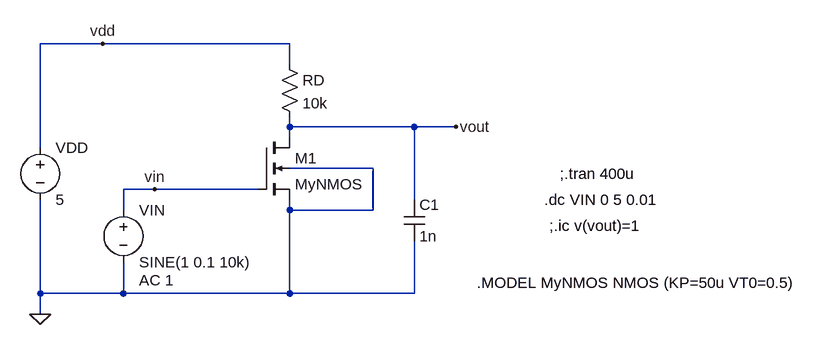
[diagram p0: schematic Figure_2-7_CS_DC_sweep.asc]
Figure_2-7_CS_DC_sweep.asc, the LTspice schematic file:
Version 4
SHEET 1 1404 680
WIRE 320 16 224 16
WIRE 608 16 320 16
WIRE 608 48 608 16
WIRE 608 144 608 128
WIRE 800 144 608 144
WIRE 864 144 800 144
WIRE 608 160 608 144
WIRE 224 176 224 16
WIRE 736 208 608 208
WIRE 400 240 352 240
WIRE 560 240 400 240
WIRE 800 256 800 144
WIRE 352 272 352 240
WIRE 608 272 608 256
WIRE 736 272 736 208
WIRE 736 272 608 272
WIRE 224 400 224 256
WIRE 352 400 352 352
WIRE 352 400 224 400
WIRE 608 400 608 272
WIRE 608 400 352 400
WIRE 800 400 800 320
WIRE 800 400 608 400
WIRE 224 432 224 400
FLAG 224 432 0
FLAG 864 144 vout
FLAG 400 240 vin
FLAG 320 16 vdd
SYMBOL nmos4 560 160 R0
SYMATTR InstName M1
SYMATTR Value MyNMOS
SYMATTR Value2 l=1u w=20u
SYMBOL voltage 352 256 R0
WINDOW 123 24 124 Left 2
WINDOW 39 0 0 Left 2
SYMATTR Value2 AC 1
SYMATTR InstName VIN
SYMATTR Value SINE(1 0.1 10k)
SYMBOL voltage 224 160 R0
WINDOW 123 0 0 Left 2
WINDOW 39 0 0 Left 2
SYMATTR InstName VDD
SYMATTR Value 5
SYMBOL res 592 32 R0
SYMATTR InstName RD
SYMATTR Value 10k
SYMBOL cap 784 256 R0
SYMATTR InstName C1
SYMATTR Value 1n
TEXT 896 384 Left 2 !.MODEL MyNMOS NMOS (KP=50u VT0=0.5)
TEXT 1024 216 Left 2 !;.tran 400u
TEXT 1000 256 Left 2 !.dc VIN 0 5 0.01
TEXT 1008 296 Left 2 !;.ic v(vout)=1

The netlist it stands for:
* Figure_2-7_CS_DC_sweep.asc
M1 vout vin 0 0 MyNMOS l=1u w=20u
VIN vin 0 SINE(1 0.1 10k) AC 1
VDD vdd 0 5
RD vdd vout 10k
C1 vout 0 1n
.model NMOS NMOS
.model PMOS PMOS
.lib standard.mos
.MODEL MyNMOS NMOS (KP=50u VT0=0.5)
;.tran 400u
.dc VIN 0 5 0.01
;.ic v(vout)=1
.backanno
.end